# Altium schematic sheet 4_periferals.SchDoc: =ProjectTitle
size A4; Address1: github.com/4pplet/Steezy60; Address2: Licence: CERN-OHL-S; SheetNumber: 4; SheetTotal: 4
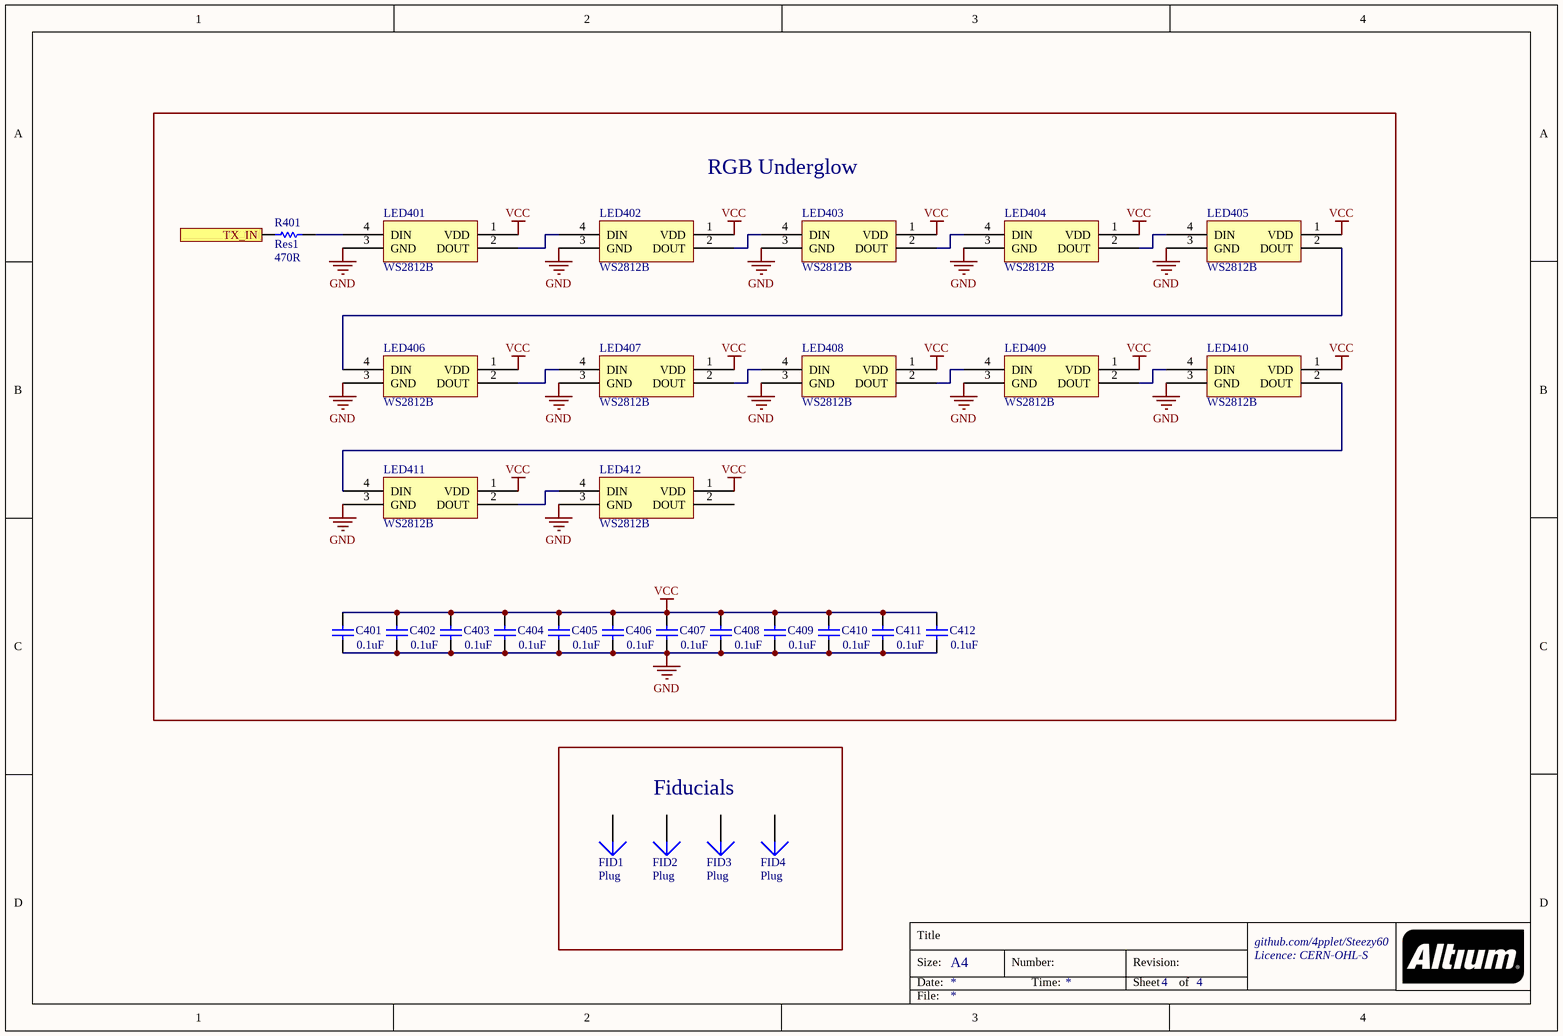
[diagram p0: 4_periferals.SchDoc]

## Parts
C401  value 0.1uF  [C0603[1608]]
C402  value 0.1uF  [C0603[1608]]
C403  value 0.1uF  [C0603[1608]]
C404  value 0.1uF  [C0603[1608]]
C405  value 0.1uF  [C0603[1608]]
C406  value 0.1uF  [C0603[1608]]
C407  value 0.1uF  [C0603[1608]]
C408  value 0.1uF  [C0603[1608]]
C409  value 0.1uF  [C0603[1608]]
C410  value 0.1uF  [C0603[1608]]
C411  value 0.1uF  [C0603[1608]]
C412  value 0.1uF  [C0603[1608]]
FID1  Plug  [Fiducial_Nordic]  (no BOM)
FID2  Plug  [Fiducial_Nordic]  (no BOM)
FID3  Plug  [Fiducial_Nordic]  (no BOM)
FID4  Plug  [Fiducial_Nordic]  (no BOM)
LED401  WS2812B  [WS2812B - 2020]
LED402  WS2812B  [WS2812B - 2020]
LED403  WS2812B  [WS2812B - 2020]
LED404  WS2812B  [WS2812B - 2020]
LED405  WS2812B  [WS2812B - 2020]
LED406  WS2812B  [WS2812B - 2020]
LED407  WS2812B  [WS2812B - 2020]
LED408  WS2812B  [WS2812B - 2020]
LED409  WS2812B  [WS2812B - 2020]
LED410  WS2812B  [WS2812B - 2020]
LED411  WS2812B  [WS2812B - 2020]
LED412  WS2812B  [WS2812B - 2020]
R401  Res1  value 470R  [R0603[1608]]

## Blocks framed on the sheet
RGB Underglow: C401-C412 LED401-LED412 R401
Fiducials: FID1-FID4

## Ports
TX_IN

## Nets
GND: C401.1 C402.1 C403.1 C404.1 C405.1 C406.1 C407.1 C408.1 C409.1 C410.1 C411.1 C412.1 LED401.3(GND) LED402.3(GND) LED403.3(GND) LED404.3(GND) LED405.3(GND) LED406.3(GND) LED407.3(GND) LED408.3(GND) LED409.3(GND) LED410.3(GND) LED411.3(GND) LED412.3(GND)
VCC: C401.2 C402.2 C403.2 C404.2 C405.2 C406.2 C407.2 C408.2 C409.2 C410.2 C411.2 C412.2 LED401.1(VDD) LED402.1(VDD) LED403.1(VDD) LED404.1(VDD) LED405.1(VDD) LED406.1(VDD) LED407.1(VDD) LED408.1(VDD) LED409.1(VDD) LED410.1(VDD) LED411.1(VDD) LED412.1(VDD)
TX_IN: R401.1 ; port TX_IN
NetLED401_2: LED401.2(DOUT) LED402.4(DIN)
NetLED401_4: LED401.4(DIN) R401.2
NetLED402_2: LED402.2(DOUT) LED403.4(DIN)
NetLED403_2: LED403.2(DOUT) LED404.4(DIN)
NetLED404_2: LED404.2(DOUT) LED405.4(DIN)
NetLED405_2: LED405.2(DOUT) LED406.4(DIN)
NetLED406_2: LED406.2(DOUT) LED407.4(DIN)
NetLED407_2: LED407.2(DOUT) LED408.4(DIN)
NetLED408_2: LED408.2(DOUT) LED409.4(DIN)
NetLED409_2: LED409.2(DOUT) LED410.4(DIN)
NetLED410_2: LED410.2(DOUT) LED411.4(DIN)
NetLED411_2: LED411.2(DOUT) LED412.4(DIN)

Not connected (* = marked no-connect by the designer): FID1 1; FID2 1; FID3 1; FID4 1; LED412 2(DOUT)

## Notes on the sheet
- Title
- Size:
- Date:
- A4
- Number:
- Time:
- Revision:
- Sheet
- of
- File:

## Library data of the parts
C401-C412 = Cap: Capacitor; MRF.Part: CC0603KRX7R9BB104; MFG: KEMET; MFGPN: C0603C104M5RACTU; LCSC MFG: YAGEO; Version: 0603 imperial; LCSC Part #: C14663
LED401-LED412 = WS2812B: MRF.Part: XL-0807RGBC-WS2812B; LCSC MFG: XINGLIGHT; LCSC Part #: C3646929
R401 = Res1: Resistor; MRF.Part: 0603WAF4700T5E; MFG: Panasonic Electronic Components; MFGPN: ERJ-3EKF5101V; LCSC MFG: Uniroyal Elec; Version: 0603 imperial; LCSC Part #: C23179